# EAGLE design 8296_Diag_J4 (EAGLE 9.6.2)
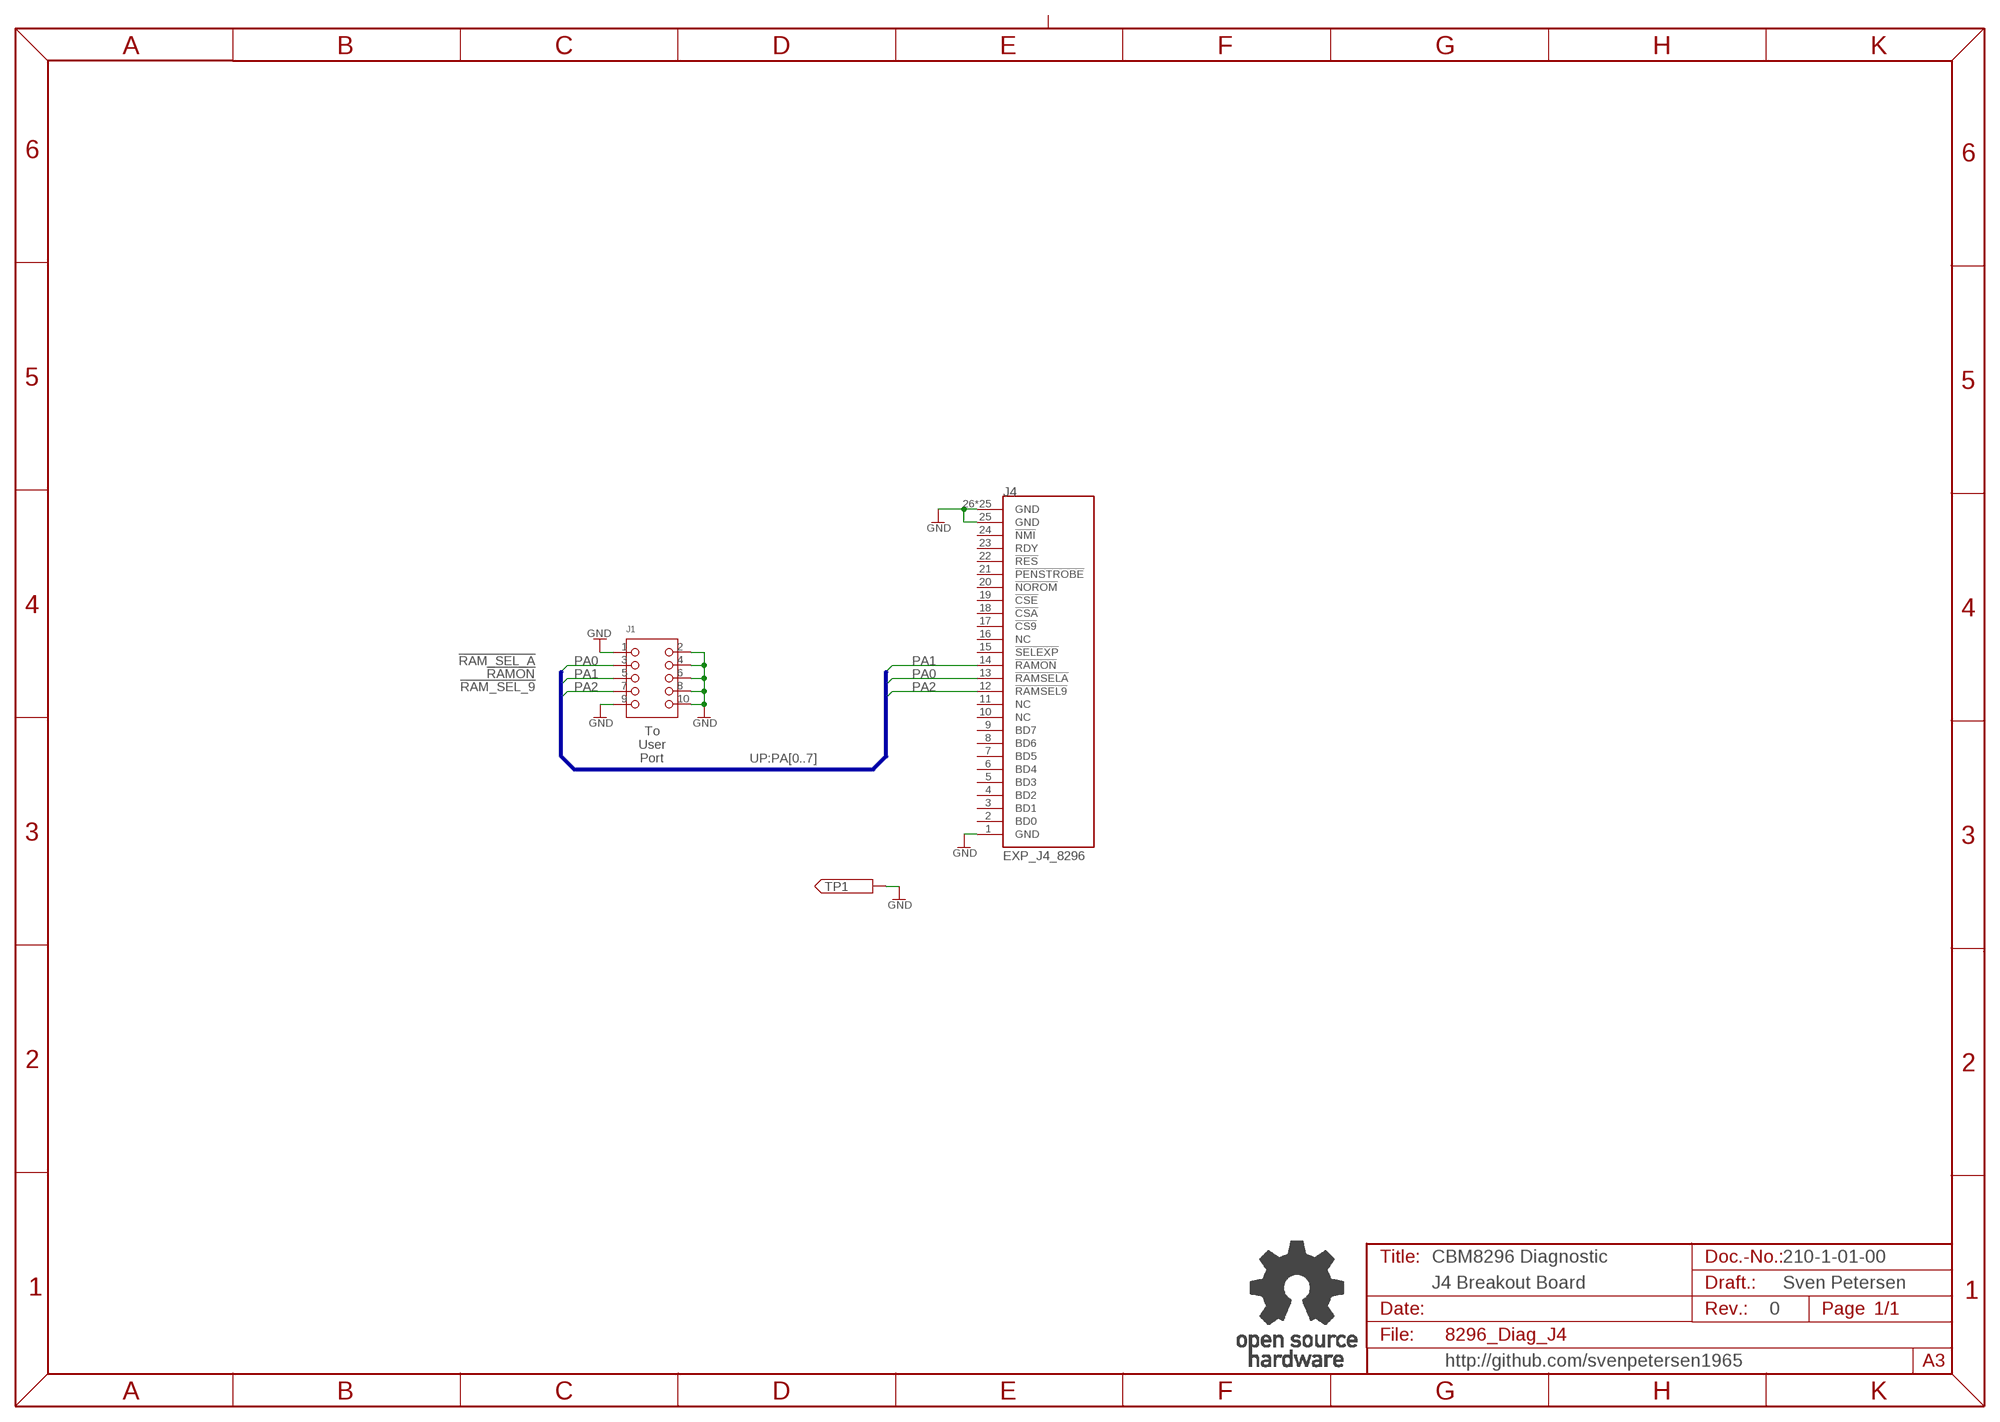
[diagram p0: schematic, sheet 1]

## Parts
J1  2X05WV  [2X05WV]
J4  EXP_J4_8296  [PET_EXPANSION_BOT]
TP1  PINHD-1X1  [1X01]
U$5  OPEN_SOURCE_HW  [OPENHW]

## Nets
GND: J1.1 J1.2 J1.4 J1.6 J1.8 J1.9 J1.10 J4.1(GND) J4.25(GND) J4.26(GND) J4.27(GND) J4.28(GND) J4.29(GND) J4.30(GND) J4.31(GND) J4.32(GND) J4.33(GND) J4.34(GND) J4.35(GND) J4.36(GND) J4.37(GND) J4.38(GND) J4.39(GND) J4.40(GND) J4.41(GND) J4.42(GND) J4.43(GND) J4.44(GND) J4.45(GND) J4.46(GND) J4.47(GND) J4.48(GND) J4.49(GND) J4.50(GND) TP1.1
PA0: J1.3 J4.13(!RAMSELA)
PA1: J1.5 J4.14(!RAMON)
PA2: J1.7 J4.12(!RAMSEL9)
Unconnected: J4.2(BD0) J4.3(BD1) J4.4(BD2) J4.5(BD3) J4.6(BD4) J4.7(BD5) J4.8(BD6) J4.9(BD7) J4.10(NC) J4.11(NC) J4.15(!SELEXP) J4.16(NC) J4.17(!CS9) J4.18(!CSA) J4.19(!CSE) J4.20(!NOROM) J4.21(!PENSTROBE) J4.22(!RES) J4.23(RDY) J4.24(!NMI)

## Buses
UP:PA[0..7]

## Notes on the sheet
- !RAM_SEL_A
- !RAMON
- !RAM_SEL_9
- To
  User
  Port
- CBM8296 Diagnostic | 210-1-01-00
- J4 Breakout Board | Sven Petersen
- 0
- http://github.com/svenpetersen1965

## Library data of the parts
J1 = PINHEAD:2X05WV
J4 = Commodore:EXP_J4_8296
TP1 = PINHEAD:PINHD-1X1
U$5 = Logo:OPEN_SOURCE_HW

## Board
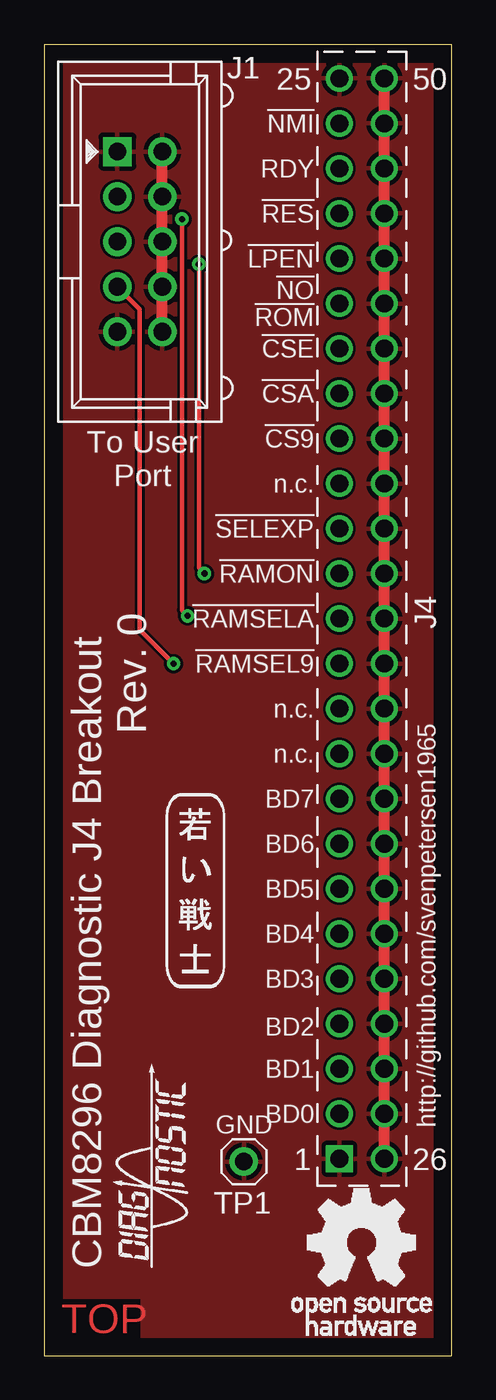
[diagram p1: board, top side]
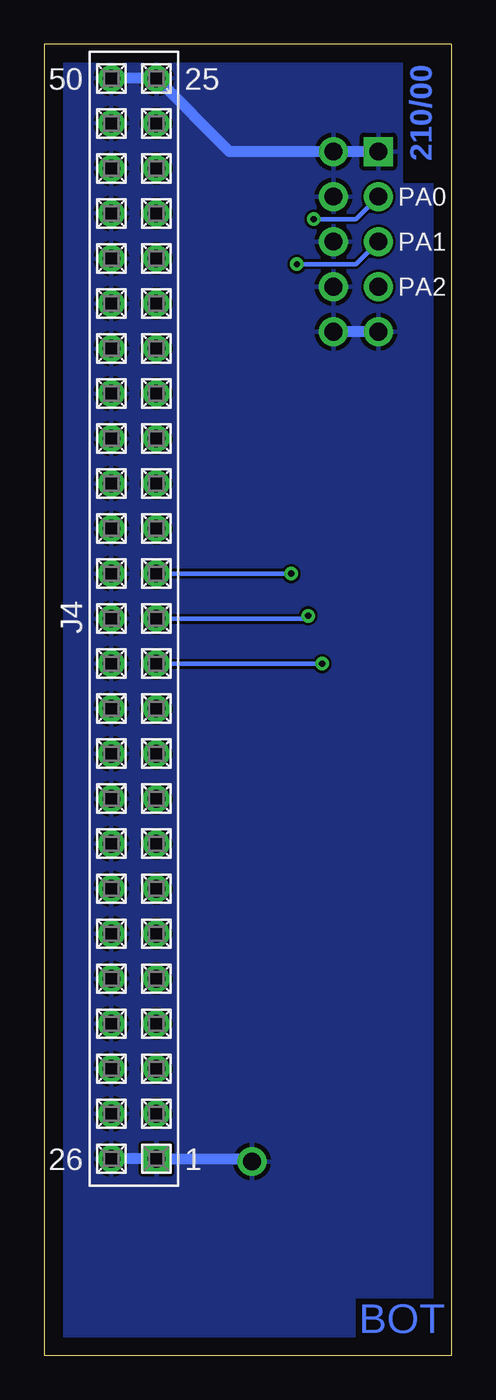
[diagram p2: board, bottom side, seen from below]

Size 23 x 74 mm. Coordinates in mm from the lower left corner, seen from the top.
Outline: 0,0 23,0 23,74 0,74 0,0
Copper layers (1*16): Top 0.035mm / dielectric 1.5mm / Bottom 0.035mm
Design rules "default *": minimum track width 6mil, minimum drill 0.35mm, track to track 6mil, track to pad 6mil, pad to pad 6mil, via to via 6mil, smd to smd 6mil, copper to edge 40mil, drill to drill 6mil, minimum pad ring 10mil, minimum via ring 8mil, stop-mask expansion 4mil, vias tented up to drill 25mil, thermal gap 10mil
bRestrict: 2 lines

### Footprints (pad centres in the part's own frame; a part is rotated, then mirrored left to right if it is on the bottom)
2X05WV = drill 1 pad 1.626 square: 1 -5.08,-1.27 | drill 1 pad 1.626: 2 -5.08,1.27; 3 -2.54,-1.27; 4 -2.54,1.27; 5 0,-1.27; 6 0,1.27; 7 2.54,-1.27; 8 2.54,1.27; 9 5.08,-1.27; 10 5.08,1.27
PET_EXPANSION_BOT = drill 1 square: 1 -1.27,-30.48 | drill 1: 2 -1.27,-27.94; 3 -1.27,-25.4; 4 -1.27,-22.86; 5 -1.27,-20.32; 6 -1.27,-17.78; 7 -1.27,-15.24; 8 -1.27,-12.7; 9 -1.27,-10.16; 10 -1.27,-7.62; 11 -1.27,-5.08; 12 -1.27,-2.54; 13 -1.27,0; 14 -1.27,2.54; 15 -1.27,5.08; 16 -1.27,7.62; 17 -1.27,10.16; 18 -1.27,12.7; 19 -1.27,15.24; 20 -1.27,17.78; 21 -1.27,20.32; 22 -1.27,22.86; 23 -1.27,25.4; 24 -1.27,27.94; 25 -1.27,30.48; 26 1.27,-30.48; 27 1.27,-27.94; 28 1.27,-25.4; 29 1.27,-22.86; 30 1.27,-20.32; 31 1.27,-17.78; 32 1.27,-15.24; 33 1.27,-12.7; 34 1.27,-10.16; 35 1.27,-7.62; 36 1.27,-5.08; 37 1.27,-2.54; 38 1.27,0; 39 1.27,2.54; 40 1.27,5.08; 41 1.27,7.62; 42 1.27,10.16; 43 1.27,12.7; 44 1.27,15.24; 45 1.27,17.78; 46 1.27,20.32; 47 1.27,22.86; 48 1.27,25.4; 49 1.27,27.94; 50 1.27,30.48
1X01 = drill 1 pad 1.626: 1 0,0

### Placement (x,y rotation side)
J1  5.4,62.87 270 top
J4  17.94,41.59 0 top
TP1  11.27,10.95 180 top
U$5  13.98,1.16 0 top
U$8  [2LAYER]  0.95,1.27 0 top
U$9  [SVEN_TAG]  8.57,26.35 0 top
U$10  [PCB-TITLE/]  0,77.15 0 top  (outside the outline)
U$12  [DIAG_SMALL]  8.1,4.92 90 top

### Tracks (layer width: path | path; a pad name or v marks a point on that pad's centre or on a via)
GND
  Top 0.61: J4.26 J4.27 J4.28 J4.29 J4.30 J4.31 J4.32 J4.33 J4.34 J4.35 J4.36 J4.37 J4.38 J4.39 J4.40 J4.41 J4.42 J4.43 J4.44 J4.45 J4.46 J4.47 J4.48 J4.49 J4.50 | J1.10 J1.8 J1.6 J1.4 J1.2
  Bottom 0.61: J4.50 J4.25 12.54,67.94 J1.2 J1.1 | J4.26 J4.1 11.43,11.11 TP1.1 | J1.9 J1.10
  pour Top: 0.79,73.03 21.91,73.03 21.91,1.11 0.79,1.11
  pour Bottom: 0.79,1.11 0.79,73.03 21.91,73.03 21.91,1.11
PA0  (via drill 0.35)
  Top 0.254: v7.78,64.14 7.78,42.07 v8.1,41.75
  Bottom 0.254: J1.3 5.4,64.14 v7.78,64.14 | J4.13 8.26,41.59 v8.1,41.75
PA1  (via drill 0.35)
  Top 0.254: v8.73,61.59 8.73,44.45 v9.05,44.13
  Bottom 0.254: J1.5 5.4,61.59 v8.73,61.59 | v9.05,44.13 J4.14
PA2  (via drill 0.35)
  Top 0.254: J1.7 5.4,59.05 5.4,40.96 v7.3,39.05
  Bottom 0.254: J4.12 v7.3,39.05

### Text on the board
Bottom: 210/00
tPlace: !NMI | RDY | !RES | !LPEN | !NO / !ROM | !CSE | !CSA | !CS9 | n.c. | !SELEXP | !RAMON | !RAMSELA | !RAMSEL9 | n.c. | Rev. 0 | n.c. | BD7 | BD6 | BD5 | BD4 | BD3 | BD2 | BD1 | BD0 | GND | http://github.com/svenpetersen1965 | CBM8296 Diagnostic J4 Breakout
bPlace: PA0 | PA1 | PA2
tNames: To User / Port
Document: Sven Petersen | 210-2-01-00 | 2023 | 35µm | 2 | 0